# Altium schematic sheet BuckConverter.A.Connectors.SchDoc
size A4; Revision: 1; SheetNumber: 2; SheetTotal: 2
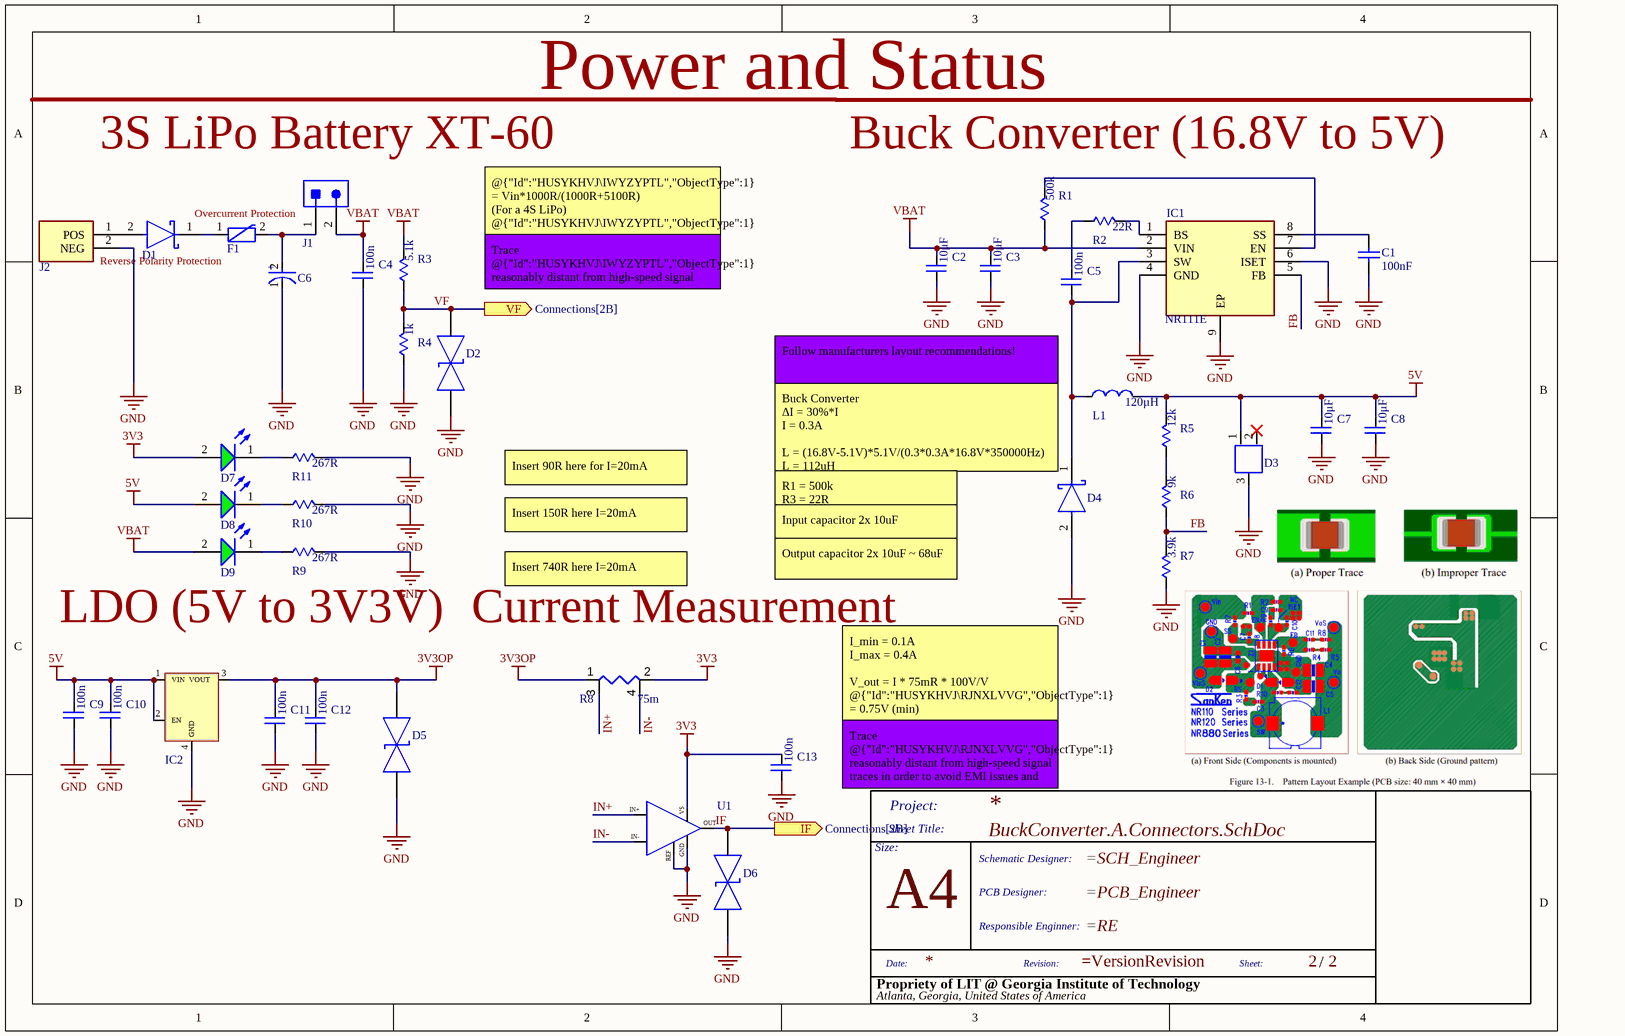
[diagram p0: BuckConverter.A.Connectors.SchDoc]

## Parts
*  Size: A4  (hidden comment: TitleBlock)  (graphical)
C1  value 100nF  [0603(1608)-CAP]  (hidden comment: GMK107B7104KAHT)
C2  GRM31CR71C106KAC7L  [1206-RES]  (value not drawn)
C3  GRM31CR71C106KAC7L  [1206-RES]  (value not drawn)
C4  KGM21NR71E104KT  [0805-RES]  (value not drawn)
C5  KGM21NR71E104KT  [CAP-0805]  (value not drawn)
C6  EEE-FK1E470P  [FP-FKD-MFG]  (value not drawn)
C7  GRM31CR71C106KAC7L  [1206-RES]  (value not drawn)
C8  GRM31CR71C106KAC7L  [1206-RES]  (value not drawn)
C9  KGM21NR71E104KT  [0805-RES]  (value not drawn)
C10  KGM21NR71E104KT  [0805-RES]  (value not drawn)
C11  KGM21NR71E104KT  [0805-RES]  (value not drawn)
C12  KGM21NR71E104KT  [0805-RES]  (value not drawn)
C13  KGM21NR71E104KT  [0805-RES]  (value not drawn)
D1  APT60S20BG  [APT60S20BG]  (value not drawn)
D2  PESD3V3Y1BSFYL  [FP-SOD962-2-CA-MFG]  (value not drawn)
D3  824021  [824021]  (value not drawn)
D4  NSR20F40NXT5G  [0603-SchottkyDIODE]  (value not drawn)
D5  PESD3V3Y1BSFYL  [FP-SOD962-2-CA-MFG]  (value not drawn)
D6  PESD3V3Y1BSFYL  [FP-SOD962-2-CA-MFG]  (value not drawn)
D7  LTST-C190KGKT  [FP-LTST-C190KGKT-MFG]  (value not drawn)
D8  LTST-C190KGKT  [FP-LTST-C190KGKT-MFG]  (value not drawn)
D9  LTST-C190KGKT  [FP-LTST-C190KGKT-MFG]  (value not drawn)
F1  MF-USHT050KX-2  [1210-IND]  (value not drawn)
IC1  NR111E  [SOIC-8-Thermally-Enhanced]
IC2  AP2114HA-3.3TRG1  [TO-261AA]  (value not drawn)
J1  61300211121  [HEADER-2-Pin]  (value not drawn)
J2  PRT-10474  [AMASS_XT60PW-M]  (value not drawn)
L1  SRR1210-121M  [SRR1210-121M]  (value not drawn)
R1  RNCF0805BTE500K  [0805-RES]  (value not drawn)
R2  RC0805FR-0722RL  [0805-RES]  (value not drawn)
R3  RC0603FR-075K1L  [0603-RES]  (value not drawn)
R4  ESR03EZPF1001  [0603-RES]  (value not drawn)
R5  RMCF0805JT12K0  [0805-RES]  (value not drawn)
R6  RT0805BRE079KL  [0805-RES]  (value not drawn)
R7  CRG0805F3K9  [0805-RES]  (value not drawn)
R8  LVK12R075DER  [LVK12R075DER]  (value not drawn)
R9  ERJ-3EKF2670V  [0603-RES]  (value not drawn)
R10  ERJ-3EKF2670V  [0603-RES]  (value not drawn)
R11  ERJ-3EKF2670V  [0603-RES]  (value not drawn)
U1  INA181A3IDBVR  [SOT95P280X145-6N]  (value not drawn)

## Ports
IF (out, see Connections[2B]), VF (out, see Connections[2B])

## Nets
3V3: C13.2 D7.2(A) R8.2(I2) U1.VS
3V3OP: C11.2 C12.2 D5.2 IC2.3(VOUT) R8.1(I1)
5V: C7.2 C8.2 C9.2 C10.2 D3.1 D8.2(A) IC2.1(VIN) IC2.2(EN) L1.2 R5.2
GND: C1.1 C2.1 C3.1 C4.1 C6.1(C) C7.1 C8.1 C9.1 C10.1 C11.1 C12.1 C13.1 D2.1 D3.3 D4.2(A) D5.1 D6.1 IC1.4(GND) IC1.6(ISET) IC1.9(EP) IC2.4(GND) J2.2(NEG) R4.1 R7.1 R9.2 R10.2 R11.2 U1.GND U1.REF
VBAT: C2.2 C3.2 C4.2 D9.2(A) IC1.2(VIN) J1.2 R1.1 R3.2
FB: IC1.5(FB) R6.1 R7.2
IF: D6.2 U1.OUT ; port IF
IN+: R8.3(E1) U1.IN+
IN-: R8.4(E2) U1.IN-
VF: D2.2 R3.1 R4.2 ; port VF
NetC1_2: C1.2 IC1.8(SS)
NetC5_1: C5.1 D4.1(C) IC1.3(SW) L1.1
NetC5_2: C5.2 R2.1
NetC6_2: C6.2(A) F1.2 J1.1
NetD1_1: D1.1(C) F1.1
NetD1_2: D1.2(A) J2.1(POS)
NetD7_1: D7.1(K) R11.1
NetD8_1: D8.1(K) R10.1
NetD9_1: D9.1(K) R9.1
NetIC1_1: IC1.1(BS) R2.2
NetIC1_7: IC1.7(EN) R1.2
NetR5_1: R5.1 R6.2

Not connected (* = marked no-connect by the designer): D3 2*

## Notes on the sheet
- Power and Status
- 3S LiPo Battery XT-60
- Buck Converter (16.8V to 5V)
- (near J1) Overcurrent Protection
- @{"Id":"HUSYKHVJ\IWYZYPTL","ObjectType":1} = Vin*1000R/(1000R+5100R)
  (For a 4S LiPo)
  @{"Id":"HUSYKHVJ\IWYZYPTL","ObjectType":1} max = 2.75V
  @{"Id":"HUSYKHVJ\IWYZYPTL","ObjectType":1} min = 2.43V
- (near J2) Reverse Polarity Protection
- Trace @{"Id":"HUSYKHVJ\IWYZYPTL","ObjectType":1} reasonably distant from high-speed signal traces in order to avoid EMI issues and noise.
- Follow manufacturers layout recommendations!
- Insert 90R here for I=20mA
- (near D4) Buck Converter
  ΔI = 30%*I
  I = 0.3A
  L = (16.8V-5.1V)*5.1V/(0.3*0.3A*16.8V*350000Hz)
  L = 112uH
- R1 = 500k
  R3 = 22R
  R4 = 9k
  R4 = (5V-0.8V/0.0002A) - 9000R
  R5 = 12k
  R6 = 0.8V/0.0002A
  R6  = 3.9k
  C3 = 0.1uF
  C7 = 0.1uF
  D1 = 40V, 5.0A
- Insert 150R here I=20mA
- Insert 740R here I=20mA
- Input capacitor 2x 10uF
- Output capacitor 2x 10uF ~ 68uF
- LDO (5V to 3V3V)
- (near R8) Current Measurement
- I_min = 0.1A
  I_max = 0.4A
  V_out = I * 75mR * 100V/V
  @{"Id":"HUSYKHVJ\RJNXLVVG","ObjectType":1} = 0.75V (min)
  @{"Id":"HUSYKHVJ\RJNXLVVG","ObjectType":1} = 3V (max)
- Trace  @{"Id":"HUSYKHVJ\RJNXLVVG","ObjectType":1} reasonably distant from high-speed signal traces in order to avoid EMI issues and noise.
- (in symbol CAP-0805-25V-100n) 100n
- (in symbol CAP-1206-16V-10uF) 10μF
- (in symbol CAP-RADIALSMD-25V(BIAS)) +
- (in symbol IND-120uH-2.3A) 120µH
- (in symbol RES-0603-1k_) 1k
- (in symbol RES-0603-5.1k) 5.1k
- (in symbol RES-0603-267R) 267R
- (in symbol RES-0805-3.9k) 3.9k
- (in symbol RES-0805-9k) 9k
- (in symbol RES-0805-12k) 12k
- (in symbol RES-0805-22R) 22R
- (in symbol RES-0805-500k) 500k
- (in symbol RES-1206-75m-KELVIN) 75m
- (in symbol TitleBlock) Project:; Sheet Title:; Size:; Schematic Designer:; PCB Designer:; Responsible Enginner:; Date:; Revision:; Sheet:; /; Propriety of LIT @ Georgia Institute of Technology; Atlanta, Georgia, United States of America

## Library data of the parts
* = TitleBlock: Standard Title Block
C1 = CMP-001-00083-1: Ceramic Capacitor, Multilayer, Ceramic, 35V, 10% +Tol, 10% -Tol, X7R, 15% TC, 0.1uF, Surface Mount, 0603; Tolerance: 10%; RoHS Compliant: Yes; Capacitor Type: Ceramic; Voltage Rating: 35V; Mounting Technology: Surface Mount; Max Operating Temperature: 125°C; Pins: 2; Min Operating Temperature: -55°C; Case/Package: 0603
C2 C3 C7 C8 = CAP-1206-16V-10uF: 10 µF ±10% 16V Ceramic Capacitor X7R 1206 (3216 Metric)
C4 C5 C9-C13 = CAP-0805-25V-100n: 0.1 µF ±10% 25V Ceramic Capacitor X7R 0805 (2012 Metric)
C6 = CAP-RADIALSMD-25V(BIAS): 47 µF 25 V Aluminum Electrolytic Capacitors Radial, Can - SMD 2000 Hrs @ 105°C; Manufacturer: Panasonic Electronic Components; Part number: EEE-FK1E470P
D1 = SCHOTTKY-TH-200V-75A: Diode 200 V 75A Through Hole TO-247 [B]
D2 D5 D6 = TVS-3V3-4V2: 3.7V (Typ) Clamp Ipp Tvs Diode Surface Mount DSN0603-2
D3 = TVS-6.1V-7V: 7V Clamp 15A (8/20µs) Ipp Tvs Diode Surface Mount SOT-23-3; pin to pad: 1>2 2>3 3>1
D4 = SCHOTTKY-0603-40V-2A: Diode 40 V 2A Surface Mount 2-DSN (1.6x0.8), (0603); Manufacturer: onsemi; Part number: NSR20F40NXT5G
D7-D9 = LED-0603-Green_: Green 571nm LED Indication - Discrete 2V 0603 (1608 Metric)
F1 = DC-FUSE-2.5A: Polymeric PTC Resettable Fuse 30V 500 mA Ih Surface Mount 1210 (3225 Metric), Concave
IC1 = CMP-031-00008-2: Integrated Circuit; Manufacturer_Name: SANKEN ELECTRIC CO.; Source: SamacSys.SchLib; Height: 1.498mm; Manufacturer_Part_Number: NR111E; Datasheet Link: https://datasheet.datasheetarchive.com/originals/distributors/Datasheets-DGA13/1278427.pdf; Design Item ID: NR111E
IC2 = LDO-6V-3V3: Linear Voltage Regulator IC Positive Fixed 1 Output 1A SOT-223-3; Manufacturer: Diodes Incorporated; Part number: AP2114HA-3.3TRG1
J1 = Header-2-Pin-Male: Connector Header Through Hole 2 position 0.100" (2.54mm); Manufacturer: Würth Elektronik; Part number: 61300211121
J2 = XT60-F: XT60 CONNECTORS FEMALE PAIR
L1 = IND-120uH-2.3A: 120 µH Shielded Drum Core, Wirewound Inductor 2.3 A 170mOhm Max Nonstandard
R1 = RES-0805-500k: 500 kOhms ±0.1% 0.125W, 1/8W Chip Resistor 0805 (2012 Metric) Automotive AEC-Q200 Thin Film
R2 = RES-0805-22R: 22 Ohms ±1% 0.125W, 1/8W Chip Resistor 0805 (2012 Metric) Moisture Resistant Thick Film
R3 = RES-0603-5.1k: 5.1 kOhms ±1% 0.1W, 1/10W Chip Resistor 0603 (1608 Metric) Moisture Resistant Thick Film; Manufacturer: YAGEO; Part number: RC0603FR-075K1L
R4 = RES-0603-1k_: 1 kOhms ±1% 0.25W, 1/4W Chip Resistor 0603 (1608 Metric) Automotive AEC-Q200, Pulse Withstanding Thick Film
R5 = RES-0805-12k: 12 kOhms ±5% 0.125W, 1/8W Chip Resistor 0805 (2012 Metric) Automotive AEC-Q200 Thick Film
R6 = RES-0805-9k: 9 kOhms ±0.1% 0.125W, 1/8W Chip Resistor 0805 (2012 Metric) Thin Film
R7 = RES-0805-3.9k: 3.9 kOhms ±1% 0.125W, 1/8W Chip Resistor 0805 (2012 Metric) Thick Film
R8 = RES-1206-75m-KELVIN: 75 mOhms ±0.5% 0.5W, 1/2W Chip Resistor 1206 (3216 Metric) Anti-Corrosive, Current Sense, Moisture Resistant Thick Film
R9-R11 = RES-0603-267R: 267 Ohms ±1% 0.1W, 1/10W Chip Resistor 0603 (1608 Metric) Automotive AEC-Q200 Thick Film; Manufacturer: Panasonic Electronic Components; Part number: ERJ-3EKF2670V
U1 = AMP-100V/V-SOT23-6: Current Sense Amplifier 1 Circuit Rail-to-Rail SOT-23-6; pin to pad: GND>2 IN+>3 IN->6 OUT>1 REF>5 VS>4; Manufacturer: Texas Instruments; Part number: INA181A3IDBVR